# Altium schematic sheet ICM模块.SchDoc
size A4
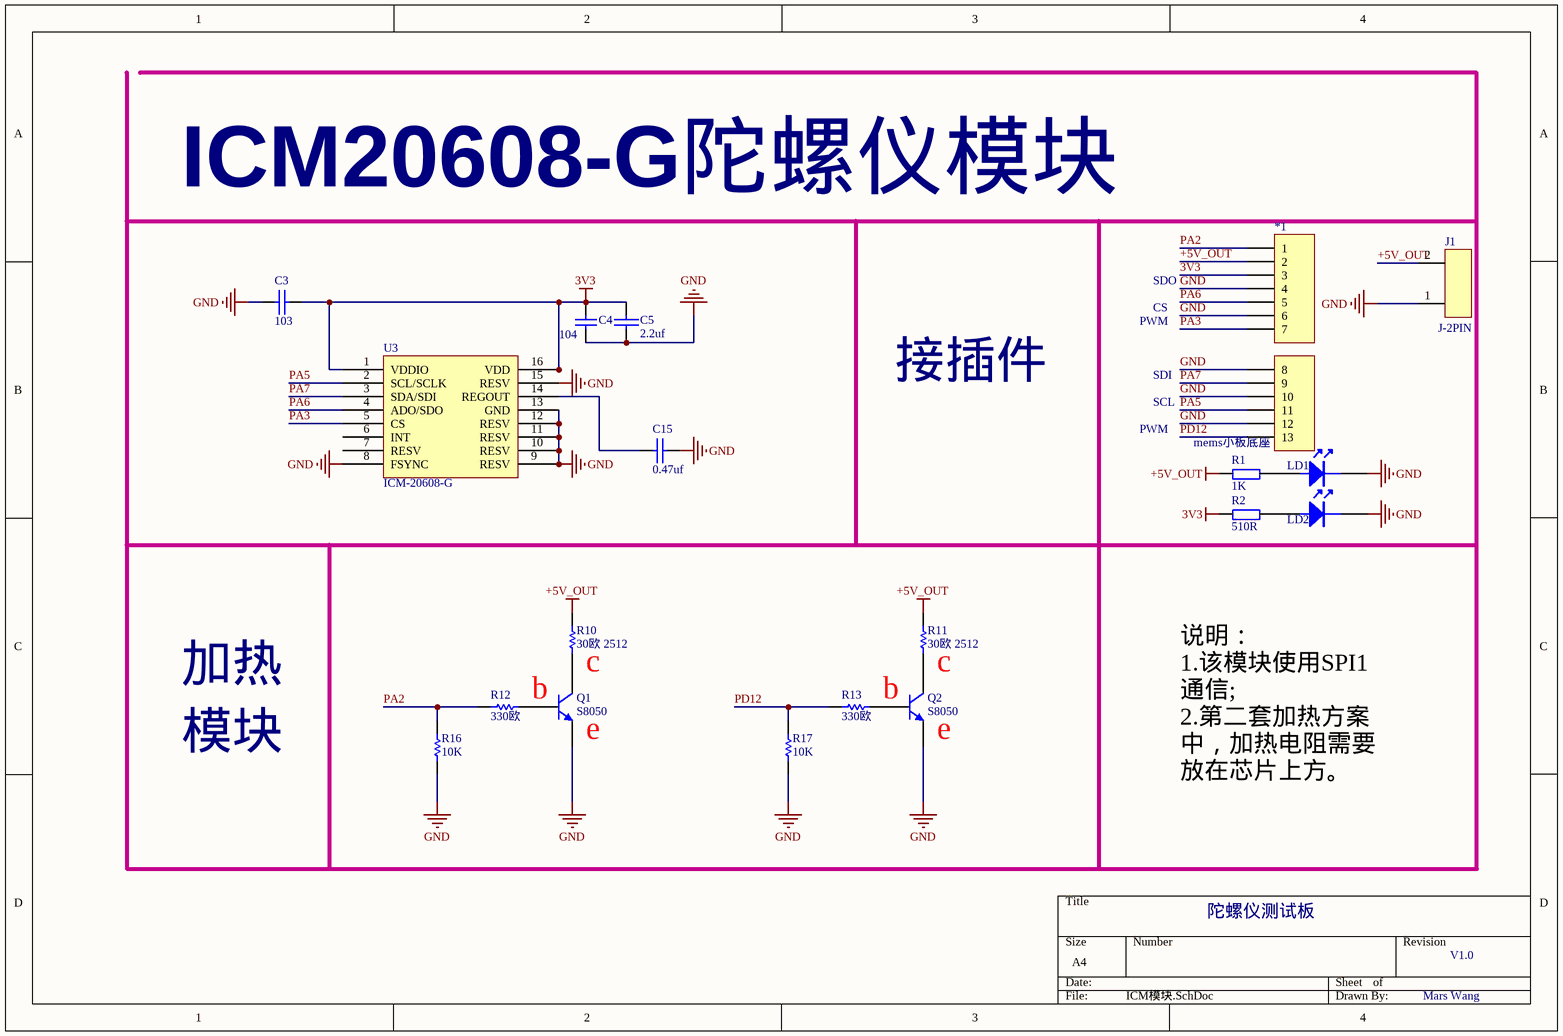
[diagram p0: ICM模块.SchDoc]

## Parts
*1  mems小板底座  [mems小板底座]
C3  103  [C-0805C]
C4  104  [C-0805C]
C5  2.2uf  [C-0805C]
C15  0.47uf  [C-0805C]
J1  J-2PIN  [J-2-2.54-xh]
LD1  (no value)  [D-0603D]
LD2  (no value)  [D-0603D]
Q1  S8050  [SOT-233-3]
Q2  S8050  [SOT-233-3]
R1  1K  [R-0603R]
R2  510R  [R-0603R]
R10  30欧 2512  [R-3925R（锰铜）]
R11  30欧 2512  [PCBComponent_1]
R12  330欧  [R-0603R]
R13  330欧  [R-0603R]
R16  10K  [R-0603R]
R17  10K  [R-0603R]
U3  ICM-20608-G  [ICM20608-G]

## Nets
3V3: *1.3 C3.1 C4.1 C5.2 R2.1 U3.1(VDDIO) U3.16(VDD)
+5V_OUT: *1.2 J1.2 R1.1 R10.2 R11.2
GND: *1.4 *1.6 *1.8 *1.10 *1.12 C3.2 C4.2 C5.1 C15.1 J1.1 LD1.2 LD2.2 Q1.3(E) Q2.3(E) R16.1 R17.1 U3.8(FSYNC) U3.9(RESV) U3.10(RESV) U3.11(RESV) U3.12(RESV) U3.13(GND) U3.15(RESV)
PA2: *1.1 R12.1 R16.2
PA3: *1.7 U3.5(CS)
PA5: *1.11 U3.2(SCL/SCLK)
PA6: *1.5 U3.4(ADO/SDO)
PA7: *1.9 U3.3(SDA/SDI)
PD12: *1.13 R13.1 R17.2
NetC15_2: C15.2 U3.14(REGOUT)
NetLD1_1: LD1.1 R1.2
NetLD2_1: LD2.1 R2.2
NetQ1_1: Q1.1(C) R10.1
NetQ1_2: Q1.2(B) R12.2
NetQ2_1: Q2.1(C) R11.1
NetQ2_2: Q2.2(B) R13.2

Not connected (* = marked no-connect by the designer): U3 6(INT) 7(RESV)

## Notes on the sheet
- ICM20608-G陀螺仪模块
- SDO
- CS
- 接插件
- PWM
- SDI
- SCL
- 加热
- b
- c
- 模块
- (near Q1) e
- (near Q2) e
- 说明：
  1.该模块使用SPI1通信;
  2.第二套加热方案中，加热电阻需要放在芯片上方。
- 陀螺仪测试板
- V1.0
- Mars Wang

## Library data of the parts
C3 C5 C15 = C-贴片电容: Capacitor
C4 = Cap: Capacitor; Published: 8-Jun-2000; LatestRevisionDate: 17-Jul-2002; LatestRevisionNote: Re-released for DXP Platform.; PackageReference: RAD-0.3; Publisher: Altium Limited
J1 = J-2PIN: SOCKET
LD1 LD2 = LED
Q1 Q2 = NPN: NPN Bipolar Transistor; Published: 8-Jun-2000; LatestRevisionDate: 17-Jul-2002; LatestRevisionNote: Re-released for DXP Platform.; PackageReference: TO-226; Publisher: Altium Limited; Code_JEDEC: TO-226-AA
R1 R2 = Resistor: RES, 10K, 5%, 0.1 W, 0603
R10-R13 R16 R17 = Res Semi: Semiconductor Resistor; Published: 8-Jun-2000; LatestRevisionDate: 17-Jul-2002; LatestRevisionNote: Re-released for DXP Platform.; PackageReference: AXIAL-0.5; Publisher: Altium Limited; PackageDescription: Axial Device, Thru-Hole; 2 Leads; 0.5 in Pin Spacing
  R10 R11: Value: 30欧 2512
  R12 R13: Value: 330欧
  R16 R17: Value: 10K